# EAGLE design SparkFun_TMC6300_Breakout (EAGLE 9.6.2)
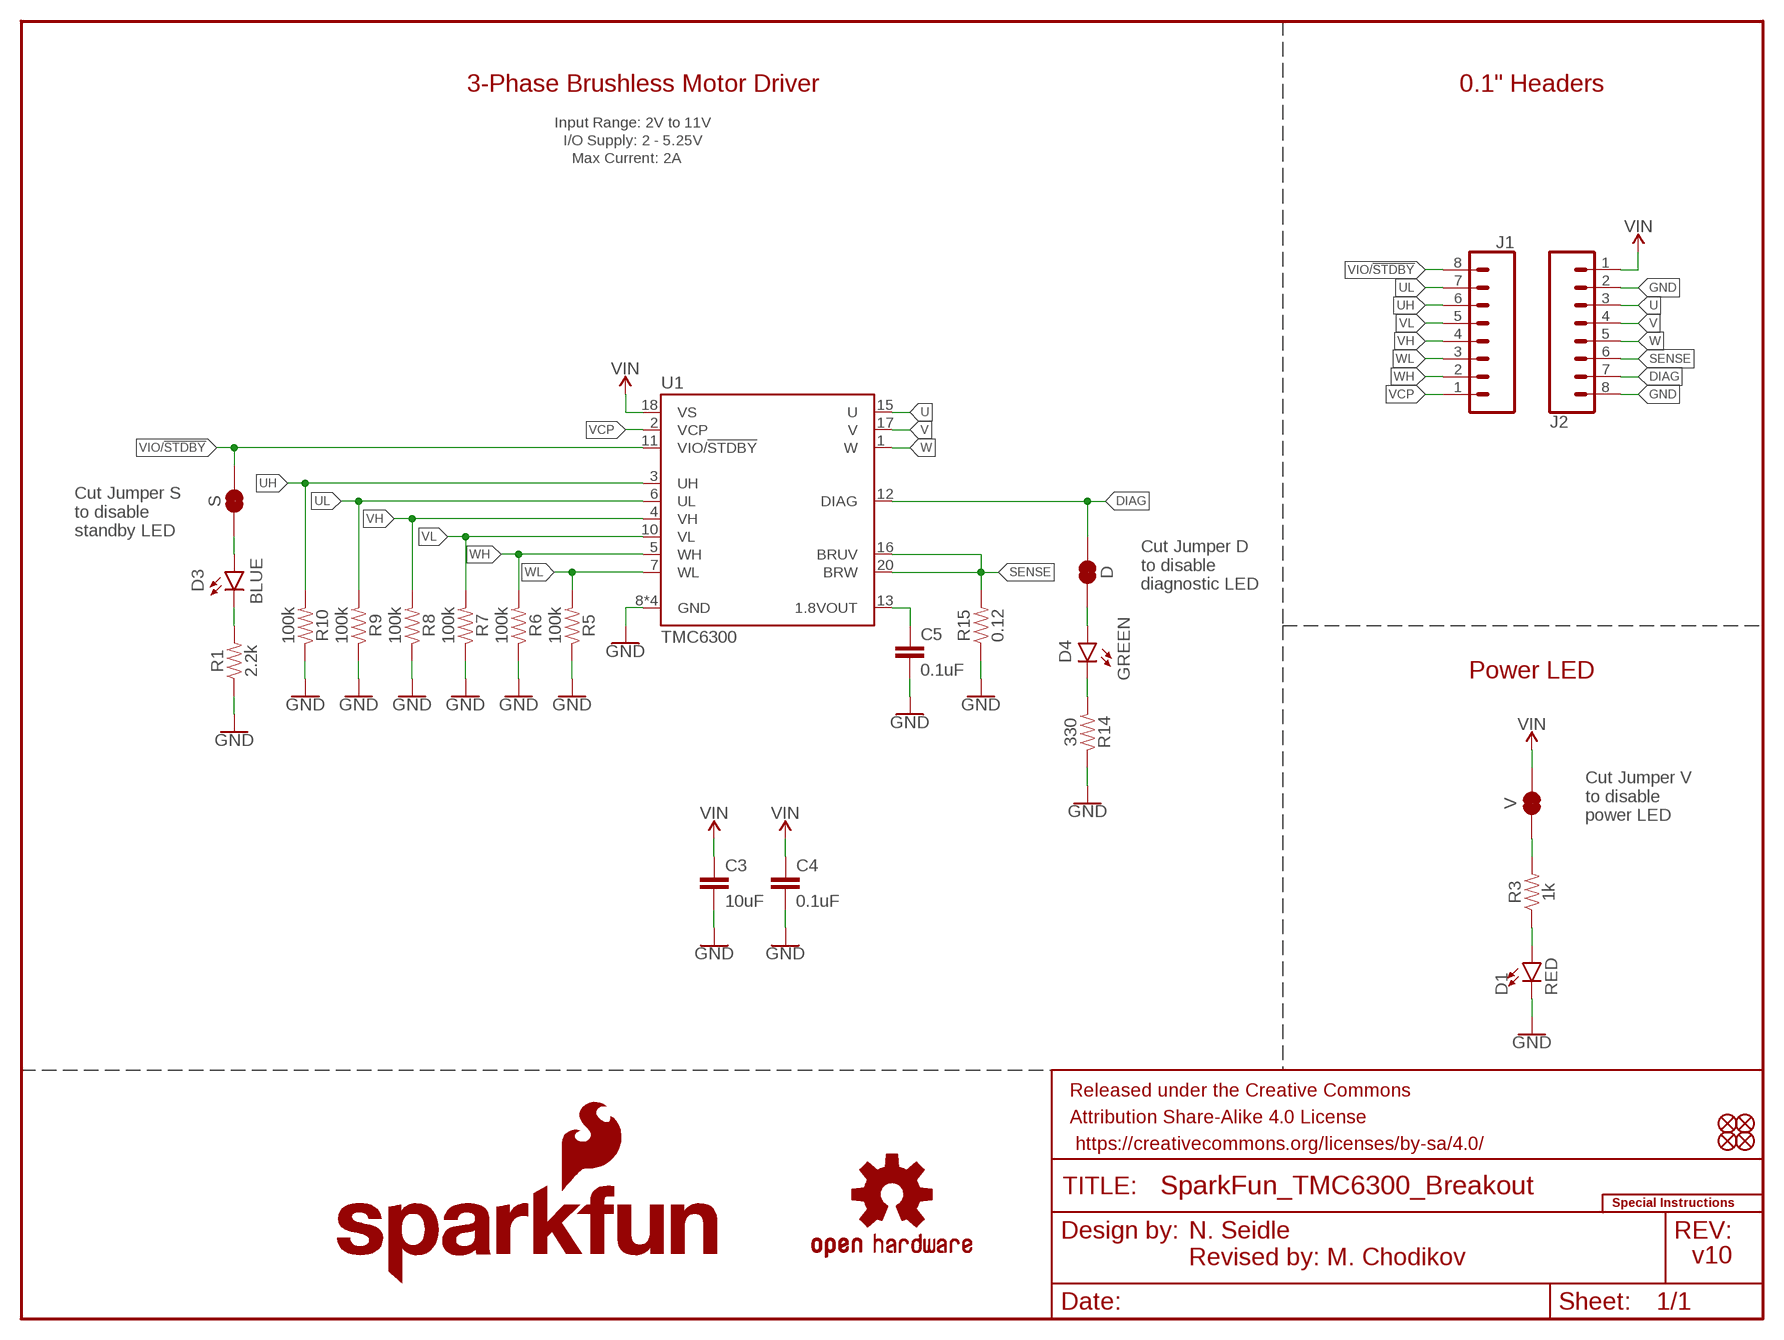
[diagram p0: schematic, sheet 1]

## Parts
C3  10uF  10UF-0805-25V-10%  [0805]
C4  0.1uF  0.1UF-0603-25V-10%-X7R-WE  [0603]
C5  0.1uF  0.1UF-0603-25V-10%-X7R-WE  [0603]
D  JUMPER-SMT_2_NC_TRACE_SILK  [SMT-JUMPER_2_NC_TRACE_SILK]
D1  RED  LED-RED0603  [LED-0603]
D3  BLUE  LED-BLUE0603  [LED-0603]
D4  GREEN  LED-GREEN0603  [LED-0603]
FD1  FIDUCIALUFIDUCIAL  [FIDUCIAL-MICRO]
FD2  FIDUCIALUFIDUCIAL  [FIDUCIAL-MICRO]
FD3  FIDUCIALUFIDUCIAL  [FIDUCIAL-MICRO]
FD4  FIDUCIALUFIDUCIAL  [FIDUCIAL-MICRO]
FRAME1  FRAME-LETTER  [CREATIVE_COMMONS]
J1  CONN_08LOCK_NO_SILK  [1X08_LOCK_NO_SILK]
J2  CONN_08LOCK_NO_SILK  [1X08_LOCK_NO_SILK]
LOGO2  SPECIAL_INSTRUCTIONS-ORDERING  [ORDERING_INSTRUCTIONS]
LOGO3  SFE_LOGO_NAME.08_INCH  [SFE_LOGO_NAME_.08]
LOGO4  SFE_LOGO_FLAME.1_INCH  [SFE_LOGO_FLAME_.1]
LOGO5  OSHW-LOGOS  [OSHW-LOGO-S]
R1  2.2k  2.2KOHM-0603-1/10W-1%  [0603]
R3  1k  1KOHM-0603-1/10W-1%  [0603]
R5  100k  100KOHM-0603-1/10W-1%  [0603]
R6  100k  100KOHM-0603-1/10W-1%  [0603]
R7  100k  100KOHM-0603-1/10W-1%  [0603]
R8  100k  100KOHM-0603-1/10W-1%  [0603]
R9  100k  100KOHM-0603-1/10W-1%  [0603]
R10  100k  100KOHM-0603-1/10W-1%  [0603]
R14  330  330OHM-0603-1/10W-1%  [0603]
R15  0.12  0.12OHM-1206-1/2W-1%  [1206]
S  JUMPER-SMT_2_NC_TRACE_SILK  [SMT-JUMPER_2_NC_TRACE_SILK]
U1  TMC6300  [QFN-20]
V  JUMPER-SMT_2_NC_TRACE_SILK  [SMT-JUMPER_2_NC_TRACE_SILK]

## Nets
DIAG: D.2 J2.7 U1.12(DIAG)
GND: C3.2 C4.2 C5.2 D1.C J2.2 J2.8 R1.1 R5.1 R6.1 R7.1 R8.1 R9.1 R10.1 R14.1 R15.1 U1.8(GND) U1.9(GND) U1.14(GND) U1.PAD(GND)
N$1: R3.2 V.1
N$4: D1.A R3.1
N$5: D3.A S.1
N$6: C5.1 U1.13(1.8VOUT)
N$9: D4.A D.1
N$10: D3.C R1.2
N$12: D4.C R14.2
SENSE: J2.6 R15.2 U1.16(BRUV) U1.20(BRW)
U: J2.3 U1.15(U)
UH: J1.6 R10.2 U1.3(UH)
UL: J1.7 R9.2 U1.6(UL)
V: J2.4 U1.17(V)
VCP: J1.1 U1.2(VCP)
VH: J1.4 R8.2 U1.4(VH)
VIN: C3.1 C4.1 J2.1 U1.18(VS) V.2
VIO/!STDBY!: J1.8 S.2 U1.11(VIO/!STDBY!)
VL: J1.5 R7.2 U1.10(VL)
W: J2.5 U1.1(W)
WH: J1.2 R6.2 U1.5(WH)
WL: J1.3 R5.2 U1.7(WL)

## Notes on the sheet
- 3-Phase Brushless Motor Driver | 0.1" Headers
- Input Range: 2V to 11V
- I/O Supply: 2 - 5.25V
- Max Current: 2A
- Cut Jumper S
  to disable 
  standby LED
- Cut Jumper D
  to disable 
  diagnostic LED
- Power LED
- Cut Jumper V
  to disable 
  power LED
- N. Seidle
- Revised by: M. Chodikov | v10

## Library data of the parts
C3 = SparkFun-Capacitors:10UF: 10.0µF ceramic capacitors A capacitor is a passive two-terminal electrical component used to store electrical energy temporarily in an electric field.; PROD_ID: CAP-14259
C4 C5 = SparkFun-Capacitors:0.1UF: 0.1µF ceramic capacitors A capacitor is a passive two-terminal electrical component used to store electrical energy temporarily in an electric field.; PROD_ID: CAP-16503
D S V = SparkFun-Jumpers:JUMPER-SMT_2_NC_TRACE: Normally closed trace jumper This jumper has a trace between two pads so it's normally closed (NC). Use a razor knife to open the connection. For best results follow the IPC guidelines for cutting traces: Cutout at least 0.063 mm (0.005 in). Remove all loose material to clean up the cut area. Seal the cut with an approved epoxy. Reapply solder to reclose the connection.
D1 = SparkFun-LED:LED-RED: Red SMD LED Used in manufacturing of most products at SparkFun Packages: 0603 - SMD 0603 package [Product Link] <http://docs.avagotech.com/docs/AV02-0551EN> 0603 SMART - SMD 0603 SMART package ( more efficient and expensive)[Product Link] <http://www.osram-os.com/Graphics/XPic2/00077099_0.pdf> 1206 - SMD1206 package [Product Link] <https://www.sparkfun.com/datasheets/DevTools/LilyPad/Q150OVS4.pdff> SparkFun Products: Pro Mini 328 -5V <https://www.sparkfun.com/products/821> RedBoard <https://www.sparkfun.com/products/12757> IOIO-OTG <https://www.sparkfun.com/products/13613>; PROD_ID: DIO-00819
D3 = SparkFun-LED:LED-BLUE: Blue SMD LED Used in manufacturing of various products at SparkFun Packages: 0603 - SMD 0603 package [Product Link] <http://www.digikey.com/product-detail/en/SMLE12BC7TT86/511-1589-2-ND/1641808> 1206 - SMD1206 package [Product Link] <http://www.digikey.com/product-detail/en/lite-on-inc/LTST-C150TBKT/160-1643-1-ND/573584> SparkFun Products: ESP8266 Thing-Dev Board <https://www.sparkfun.com/products/13711> RedBoard <https://www.sparkfun.com/products/12757>; PROD_ID: DIO-08575
D4 = SparkFun-LED:LED-GREEN: Green SMD LED Used in manufacturing of various products at SparkFun Packages: 0603 - SMD 0603 package [Product Link] <http://www.futureelectronics.com/en/technologies/semiconductors/optoelectronics/leds/Pages/9894312-LTST-C190GKT.aspx?CrossPart=HSMG-C190&IM=0> LilyPad 1206 - SMD1206 LilyPad package [Product Link] <http://www.futureelectronics.com/en/Technologies/Product.aspx?ProductID=IN150NGHARVATEKCORPORATION2049943&IM=0> 1206 - SMD1206 package [Product Link] <http://www.futureelectronics.com/en/technologies/semiconductors/optoelectronics/leds/Pages/8315665-LTST-C150KGKT.aspx?IM=0> 1206 Bottom Mount -SMD 1206 Bottom Mount [Product Link] <http://www.digikey.com/product-detail/en/lite-on-inc/LTST-C230KGKT/160-1456-1-ND/386854> SparkFun Products: Pro Mini 328 -5V <https://www.sparkfun.com/products/821> RedBoard <https://www.sparkfun.com/products/12757> MP3 Trigger <https://www.sparkfun.com/products/13720> Makey Makey <https://www.sparkfun.com/products/11076>; PROD_ID: DIO-00821
FD1-FD4 = SparkFun-Aesthetics:FIDUCIAL: Fiducial Alignment Points Point-of-reference for pick-and-place machines and other optical instruments.
FRAME1 = SparkFun-Aesthetics:FRAME-LETTER: Schematic Frame - Letter Standard 8.5x11 US Letter frame; DESIGNER: Ricardo Ramos
J1 J2 = SparkFun-Connectors:CONN_08: Multi connection point. Often used as Generic Header-pin footprint for 0.1 inch spaced/style header connections On any of the 0.1 inch spaced packages, you can populate with these: Break Away Headers - Straight <https://www.sparkfun.com/products/116> (PRT-00116) Break Away Male Headers - Right Angle <https://www.sparkfun.com/products/553> (PRT-00553) Female Headers <https://www.sparkfun.com/products/115> (PRT-00115) Break Away Headers - Machine Pin <https://www.sparkfun.com/products/117> (PRT-00117) Break Away Female Headers - Swiss Machine Pin <https://www.sparkfun.com/products/743> (PRT-00743) Arduino Stackable Header - 8 Pin <https://www.sparkfun.com/products/9279> (PRT-09279) For SCREWTERMINALS and SPRING TERMINALS visit here: Screw Terimnals on SparkFun.com <https://www.sparkfun.com/search/results?term=Screw+Terminals> (5mm/3.5mm/2.54mm spacing) This device is also useful as a general connection point to wire up your design to another part of your project. Our various solder wires solder well into these plated through hole pads. Hook-Up Wire - Assortment (Stranded, 22 AWG) <https://www.sparkfun.com/products/11375> (PRT-11375) Hook-Up Wire - Assortment (Solid Core, 22 AWG) <https://www.sparkfun.com/products/11367> (PRT-11367) View the entire wire category on our website here <https://www.sparkfun.com/categories/141> Special notes: Molex polarized connector foot print use with SKU : PRT-08231 with associated crimp pins and housings. 1MM SMD Version SKU: PRT-10208 NOTES ON THE VARIANTS LOCK and LOCK_LONGPADS... This footprint was designed to help hold the alignment of a through-hole component (i.e. 6-pin header) while soldering it into place. You may notice that each hole has been shifted either up or down by 0.005 of an inch from it's more standard position (which is a perfectly straight line). This slight alteration caused the pins (the squares in the middle) to touch the edges of the holes. Because they are alternating, it causes a "brace" to hold the component in place. 0.005 has proven to be the perfect amount of "off-center" position when using our standard breakaway headers. Although looks a little odd when you look at the bare footprint, once you have a header in there, the alteration is very hard to notice. Also,if you push a header all the way into place, it is covered up entirely on the bottom side.
LOGO2 = SparkFun-Aesthetics:SPECIAL_INSTRUCTIONS: Special Ordering/Production Instructions Alert Symbol for special PCB ordering instructions or unique production process warnings. Ordering Instructions Production Instructions Types of information that should be added to box: Copper weight Soldermask color Silk color PCB thickness Number of layers PCB Standard: 1.6mm FR4 1 oz copper immersion silver plating red soldermask white silkscreen Types of information that should be added to box: Special wash requirements Depaneling instructions Humidification Glue curing Default text settings: 0.07 inch 9% ratio 50% line distance
LOGO3 = SparkFun-Aesthetics:SFE_LOGO_NAME: SparkFun Font Logo This is the SparkFun name logo. The logo on the schematic will always be the same size; the package variant is the height of the flame part of the logo (or the height the flame would be, if it were drawn). Default layer for the logo on the board is tSilk.
LOGO4 = SparkFun-Aesthetics:SFE_LOGO_FLAME: SparkFun Flame Logo This is the SparkFun flame logo. The logo on the schematic will always be the same size; the package variant is the height of the flame. Default layer for the logo on the board is tSilk.
LOGO5 = SparkFun-Aesthetics:OSHW-LOGO: Open-Source Hardware (OSHW) Logo This logo indicates the piece of hardware it is found on incorporates a OSHW license and/or adheres to the definition of open source hardware found here: http://freedomdefined.org/OSHW
R1 = SparkFun-Resistors:2.2KOHM: 2.2kΩ resistor A resistor is a passive two-terminal electrical component that implements electrical resistance as a circuit element. Resistors act to reduce current flow, and, at the same time, act to lower voltage levels within circuits. - Wikipedia; PROD_ID: RES-08272
R3 = SparkFun-Resistors:1KOHM: 1kΩ resistor A resistor is a passive two-terminal electrical component that implements electrical resistance as a circuit element. Resistors act to reduce current flow, and, at the same time, act to lower voltage levels within circuits. - Wikipedia; PROD_ID: RES-07856
R5-R10 = SparkFun-Resistors:100KOHM: 100kΩ resistor A resistor is a passive two-terminal electrical component that implements electrical resistance as a circuit element. Resistors act to reduce current flow, and, at the same time, act to lower voltage levels within circuits. - Wikipedia; PROD_ID: RES-07828
R14 = SparkFun-Resistors:330OHM: 330Ω resistor A resistor is a passive two-terminal electrical component that implements electrical resistance as a circuit element. Resistors act to reduce current flow, and, at the same time, act to lower voltage levels within circuits. - Wikipedia; PROD_ID: RES-00818
R15 = SparkFun-Resistors:0.12OHM: 0.12Ω resistor A resistor is a passive two-terminal electrical component that implements electrical resistance as a circuit element. Resistors act to reduce current flow, and, at the same time, act to lower voltage levels within circuits. - Wikipedia; PROD_ID: RES-17192
U1 = TMC6300:TMC6300; PROD_ID: IC-17193

## Board
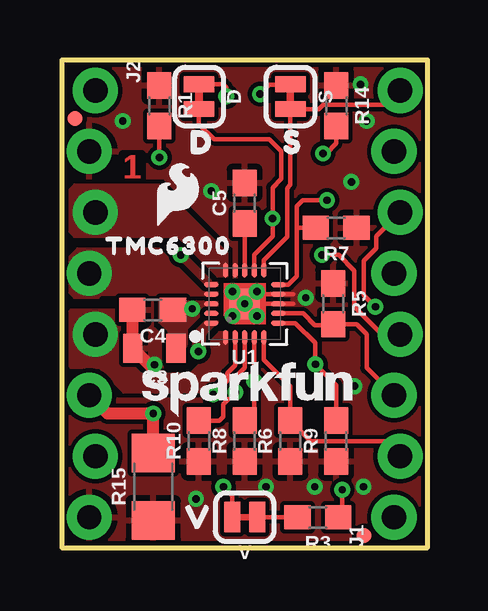
[diagram p1: board, top side]
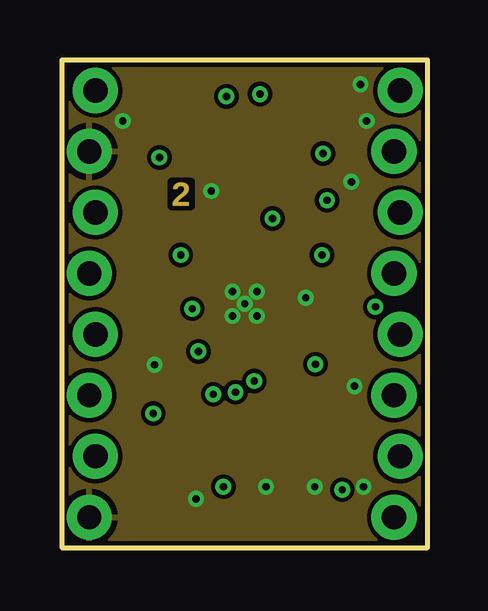
[diagram p2: board, inner layer Route2]
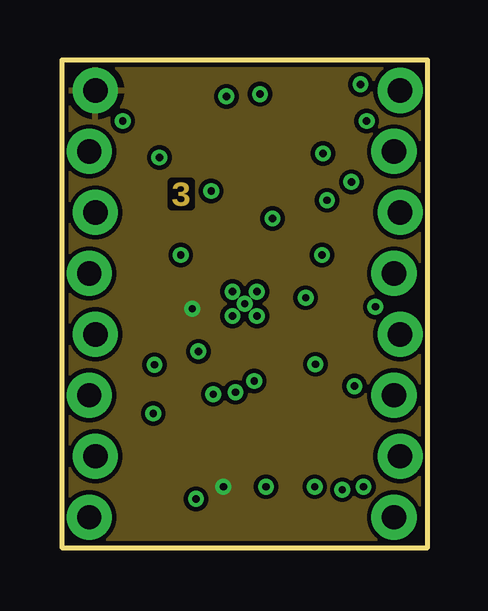
[diagram p3: board, inner layer Route15]
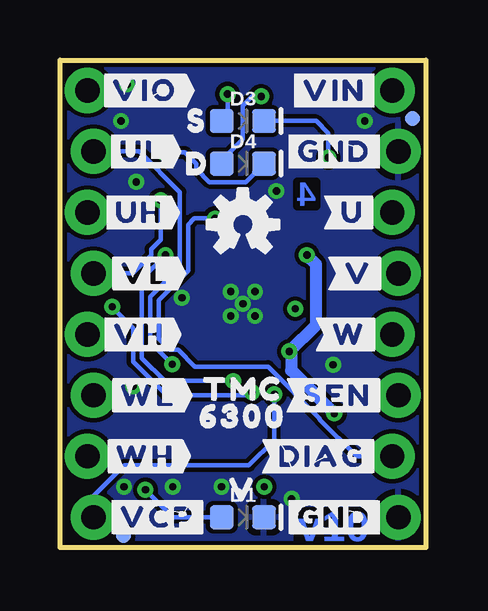
[diagram p4: board, bottom side, seen from below]

Size 15.24 x 20.32 mm. Coordinates in mm from the lower left corner, seen from the top.
Outline: 0,0 15.24,0 15.24,20.32 0,20.32 0,0
Copper layers (1+2*15+16): Top 0.035559375mm / dielectric 0.47751875mm / Route2 0.035559375mm / dielectric 0.47751875mm / Route15 0.035559375mm / dielectric 0.47751875mm / Bottom 0.035559375mm
Design rules "SparkFun-4-Layer-General-JLCPCB": minimum track width 7mil, minimum drill 12mil, track to track 7mil, track to pad 7mil, pad to pad 7mil, via to via 7mil, smd to smd 7mil, copper to edge 7mil, drill to drill 7mil, minimum pad ring 7mil, minimum via ring 7mil, stop-mask expansion 3mil, vias tented up to drill 25mil, thermal gap 10mil
tRestrict: area 8.8,10.2 to 9.1,10.5

### Footprints (pad centres in the part's own frame; a part is rotated, then mirrored left to right if it is on the bottom)
0805 = smd 0.8 x 1.2: 1 -0.9,0; 2 0.9,0
0603 = smd 1.1 x 1: 1 -0.85,0; 2 0.85,0
SMT-JUMPER_2_NC_TRACE_SILK = smd 0.66 x 1.27: 1 -0.521,0; 2 0.521,0
LED-0603 = smd 1 x 1: A -0.877,0; C 0.877,0
FIDUCIAL-MICRO = smd 0.635 x 0.635: 1 0,0
1X08_LOCK_NO_SILK = drill 1.016 pad 1.88: 1 0,0.127; 2 2.54,-0.127; 3 5.08,0.127; 4 7.62,-0.127; 5 10.16,0.127; 6 12.7,-0.127; 7 15.24,0.127; 8 17.78,-0.127
1206 = smd 1.6 x 1.8: 1 -1.4,0; 2 1.4,0
QFN-20 = smd 0.6 x 0.2: 1 -1.4,0.8; 2 -1.4,0.4; 3 -1.4,0; 4 -1.4,-0.4; 5 -1.4,-0.8; 11 1.4,-0.8; 12 1.4,-0.4; 13 1.4,0; 14 1.4,0.4; 15 1.4,0.8 | smd 0.2 x 0.6: 6 -0.8,-1.4; 7 -0.4,-1.4; 8 0,-1.4; 9 0.4,-1.4; 10 0.8,-1.4; 16 0.8,1.4; 17 0.4,1.4; 18 0,1.4; 19 -0.4,1.4; 20 -0.8,1.4 | smd 1.27 x 1.27: PAD 0,0

### Placement (x,y rotation side)
C3  3.86,8.31 180 top
C4  3.78,9.91 180 top
C5  7.62,14.35 90 top
D  5.71,18.8 270 top
D1  7.62,1.27 0 bottom
D3  7.62,17.78 0 bottom
D4  7.62,16 0 bottom
FD1  0.56,17.88 180 top
FD2  12.6,0.51 180 top
FD3  12.6,0.51 180 bottom
FD4  0.56,17.88 180 bottom
FRAME1  -11.43,-31.75 0 top  (outside the outline)
J1  13.97,1.27 90 top
J2  1.27,19.05 270 top
LOGO2  21.59,50.8 0 top  (outside the outline)
LOGO3  7.62,6.73 0 top
LOGO4  4.83,14.73 0 top
LOGO5  7.62,13.46 0 bottom
R1  4.06,18.41 270 top
R3  10.67,1.27 180 top
R5  11.3,10.16 270 top
R6  9.53,4.45 90 top
R7  11.43,13.34 180 top
R8  7.62,4.45 90 top
R9  11.43,4.45 90 top
R10  5.71,4.45 90 top
R14  11.43,18.41 270 top
R15  3.81,2.54 90 top
S  9.53,18.8 270 top
U1  7.62,10.16 90 top
U$1  [#GND#1]  3.81,16.51 0 bottom
U$2  [#SEN#0]  3.68,6.35 0 bottom
U$3  [#DIAG#0]  4.32,3.81 0 bottom
U$4  [TMC630063003454]  4.45,12.57 0 top
U$9  [#U#6]  3.05,13.97 0 bottom
U$12  [#VCP#0]  11.18,1.27 0 bottom
U$13  [#VIO#1]  11.68,19.05 0 bottom
U$15  [63001]  7.62,5.46 0 bottom
U$16  [D0]  5.84,16.89 0 top
U$18  [D0]  9.53,16 0 bottom
U$19  [S1]  9.53,17.78 0 bottom
U$20  [V2]  7.62,2.41 0 bottom
U$21  [#UH#5]  11.94,13.97 0 bottom
U$22  [#UL#4]  11.81,16.51 0 bottom
U$23  [TMC0]  7.62,6.6 0 bottom
U$24  [#VIN#0]  3.81,19.05 0 bottom
U$25  [#V#7]  2.79,11.43 0 bottom
U$26  [V2]  5.71,1.27 0 top
U$27  [S1]  9.65,16.89 0 top
U$28  [#GND#1]  3.81,1.27 0 bottom
U$30  [#VH#2]  11.94,8.89 0 bottom
U$31  [#VL#3]  11.68,11.43 0 bottom
U$32  [#W#8]  3.17,8.89 0 bottom
U$33  [#WH#1]  11.68,3.81 0 bottom
U$34  [#WL#0]  11.56,6.35 0 bottom
V  7.62,1.27 180 top

### Tracks (layer width: path | path; a pad name or v marks a point on that pad's centre or on a via)
DIAG  (via drill 0.3)
  Top 0.178: D.2 5.71,17.65 6.35,17.02 8.64,17.02 9.14,16.51 9.14,15.37 8.78,15 v8.78,13.72 8.78,12.97 8.06,12.26 8.02,12.21 U1.12
  Bottom 0.178: J2.7 2.88,3.81 4.41,5.34 4.41,5.38 6.57,7.54 9.62,7.54 10.32,8.24 10.66,8.24 11.12,8.71 11.12,10.31 9.89,11.54 9.89,13.46 9.64,13.72 v8.78,13.72
GND  (via drill 0.3)
  Top 0.178: 8.38,10.16 U1.8 9.65,10.16 | v8.13,10.67 8.24,10.56 U1.9 9.63,10.56
  Top 0.508: C4.2 2.94,8.51 | v3.86,7.62 3.65,7.62 C3.2
  other vias: 7.11,9.65 8.13,9.65 5.59,2.03 10.54,2.54 12.57,2.54 8.51,2.54 12.45,19.3 10.16,10.41 12.7,17.78 12.06,15.24 12.19,6.73 7.11,10.67 7.62,10.16 2.54,17.78 6.22,14.86
  pour Bottom (isolate 0.127, rank 5): 15.24,0 0,0 0,20.32 15.24,20.32
  pour Route2 (isolate 0.127): 0,0 15.24,0 15.24,20.32 0,20.32
  pour Top (isolate 0.127, rank 5): 0,0 15.24,0 15.24,20.32 0,20.32
N$1
  Top 0.178: R3.2 V.1
N$4  (via drill 0.3)
  Top 0.178: v11.68,2.41 11.68,1.44 R3.1
  Bottom 0.178: D1.A 10.54,1.27 v11.68,2.41
N$5  (via drill 0.3)
  Top 0.178: v8.26,18.9 8.64,19.28 9.49,19.28 S.1
  Bottom 0.178: D3.A 8.26,18.02 v8.26,18.9
N$6
  Top 0.178: U1.13 C5.1
N$9  (via drill 0.3)
  Top 0.178: v6.86,18.8 6.86,19.18 6.73,19.32 D.1
  Bottom 0.178: D4.A 8.5,16.15 7.62,17.03 7.62,18.42 7.24,18.8 v6.86,18.8
N$10  (via drill 0.3)
  Top 0.178: R1.2 v4.06,16.26
  Bottom 0.178: v4.06,16.26 4.06,17.27 4.57,17.78 D3.C
N$12  (via drill 0.3)
  Top 0.178: R14.2 11.43,16.85 11.01,16.42 v10.88,16.42
  Bottom 0.178: v10.88,16.42 10.83,16.47 10.04,16.47 9.56,15.99 9.56,15.78 9.02,15.23 7.51,15.23 D4.C
SENSE  (via drill 0.3)
  Top 0.508: R15.2 v3.81,5.59 1.91,5.59 J2.6
  Bottom 0.508: v4.95,12.19 4.57,11.81 4.57,9.3 v5.69,8.18 5.61,8.1 5.61,7.39 v3.81,5.59
  pour Top (isolate 0.127, rank 3, no thermals): 6.48,10.92 5.71,10.92 4.51,12.13 4.95,12.57 6.48,11.05
  pour Top (isolate 0.127, rank 3, no thermals): 6.5,9.42 5.74,9.42 5.33,9.02 5.33,8.26 5.97,8.26 5.97,8.89
U
  pour Top (isolate 0.127, rank 2, no thermals): 6.48,11.3 4.83,12.95 0.51,12.95 0.13,13.34 0.13,14.73 0.51,15.11 4.06,15.11 6.88,12.29 6.88,11.3
UH  (via drill 0.3)
  Top 0.178: R10.2 6.57,5.29 6.73,5.46 6.73,5.97 v7.24,6.48 7.24,7.11 7.62,7.49 U1.3 | v13.07,10.04 12.57,10.53 12.57,11.95 13.1,12.47 13.1,12.97 J1.6
  Bottom 0.178: v7.24,6.48 7.37,6.35 10.79,6.35 12.19,7.75 12.19,9.14 13.07,10.02 v13.07,10.04
UL  (via drill 0.3)
  Top 0.178: R9.2 11.43,6.78 v10.56,7.64 10.56,8.53 9.73,9.36 U1.6
  Bottom 0.178: v10.56,7.64 11.48,8.56 11.48,10.46 10.25,11.69 10.25,14.82 11.94,16.51 J1.7
V
  pour Top (isolate 0.127, no thermals): 6.48,10.52 5.33,10.52 5.31,10.54 1.65,10.54 1.52,10.41 0.51,10.41 0.13,10.79 0.13,11.94 0.64,12.45 4.06,12.45 5.84,10.67 6.48,10.67
VCP  (via drill 0.3)
  Top 0.178: v6.31,6.39 6.88,6.97 6.88,7.26 7.22,7.6 U1.2
  Bottom 0.178: J1.1 13.84,2.16 12.57,3.43 7.37,3.43 6.31,4.49 v6.31,6.39
VH  (via drill 0.3)
  Top 0.178: R8.2 7.62,5.33 8.02,5.73 v8.02,6.95 U1.4 | v10.84,12.19 10.86,12.21 11.53,12.21 12.19,11.55 12.19,10.03 13.34,8.89 J1.4
  Bottom 0.178: v10.84,12.19 11.84,11.2 11.84,7.9 10.88,6.95 v8.02,6.95
VIN  (via drill 0.3)
  Top 0.178: V.2 7.1,2.17 v6.73,2.54
  other vias: 5.44,9.96
  pour Top (isolate 0.127, rank 2, no thermals): 4.06,10.54 5.08,10.54 5.33,10.29 6.48,10.29 6.48,10.03 6.15,10.03 5.21,9.09 5.21,8.38 4.45,8.38 4.45,9.02 4.06,9.4
  pour Route15 (isolate 0.127): 0,0 15.24,0 15.24,20.32 0,20.32
VIO/!STDBY!
  Top 0.178: J1.8 14.1,18.97 13.58,18.45 10.89,18.45 10.71,18.27 S.2 9.53,15.11 9.4,14.99 9.4,12.95 8.42,11.98 U1.11
VL  (via drill 0.3)
  Top 0.178: 9.78,13.34 9.78,11.3 9.44,10.96 U1.10 | 9.78,13.34 9.78,14.22 10.03,14.48 v11.05,14.48 | R7.2 9.78,13.34
  Bottom 0.178: v11.05,14.48 11.05,12.83 11.44,12.44 11.44,12.19 12.2,11.43 J1.5
W
  pour Top (isolate 0.127, no thermals): 6.91,8.97 6.91,7.52 5.87,6.48 2.57,6.48 1.55,7.49 0.38,7.49 0.13,7.75 0.13,9.65 0.38,9.91 2.29,9.91 2.41,9.78 2.41,8.13 3.3,7.24 5.33,7.24 6.22,8.13 6.22,8.64 6.55,8.97
WH
  Top 0.178: J1.2 13.46,4.45 10.38,4.45 R6.2 9.53,6.73 8.42,7.84 U1.5
WL
  Top 0.178: J1.3 12.7,7.49 12.7,8.89 12.28,9.31 R5.2 11.26,9.27 10.54,9.27 10.05,9.76 U1.7

### Text on the board
Top: 1
Route2: 2
Route15: 3
Bottom: 4 | v10
Measures: Dimensions in inches
tDocu: Board thickness is 1.6mm | 4 Layer Board | N. Seidle | Revised by: M. Chodikov